# Altium schematic sheet GNSS Antenna.SchDoc: GNSS Antenna & LNA
size 292 x 193 mm; SheetNumber: 14; SheetTotal: 15
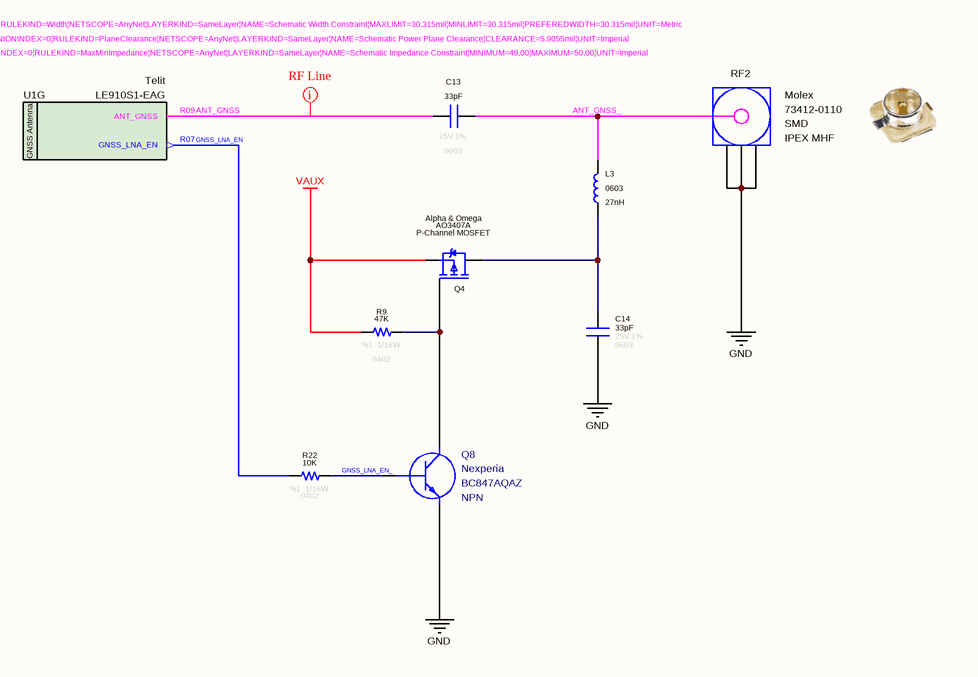
[diagram p0: GNSS Antenna.SchDoc]

## Parts
C13  value 33pF  Tolerance: 1%  Case: 0603  Voltage: 25V  [CAPACITOR_0603]  (hidden comment: Capacitor - 33pF [0603] (Ceramic))
C14  value 33pF  Tolerance: 1%  Case: 0603  Voltage: 25V  [CAPACITOR_0603]  (hidden comment: Capacitor - 33pF [0603] (Ceramic))
L3  value 27nH  Case: 0603  [INDUCTOR_0603]  (hidden comment: Fixed Inductor)
Q4  Manufacturer Name: Alpha & Omega  Manufacturer Part Number: AO3407A  Polarity: P-Channel MOSFET  [SOT-23-3 (Mosfet)]  (hidden comment: BC847AQAZ)
Q8  Manufacturer Name: Nexperia  Polarity: NPN  [SOT1215]  (hidden comment: BC847AQAZ)
R9  value 47K  Tolerance: %1  Case: 0402  Power: 1/16W  [RESISTOR_0402]  (hidden comment: 47K - 0402 - %1 - 1/16W)
R22  value 10K  Tolerance: %1  Case: 0402  Power: 1/16W  [RESISTOR_0402]  (hidden comment: 10K - 0402 - %1 - 1/16W)
RF2  Connector Type: IPEX MHF  Case: SMD  Manufacturer Name: Molex  [Connector_IPEX]  (hidden comment: 73412-0110)
U1  Manufacturer Part Number: LE910S1-EAG  Manufacturer Name: Telit  [LE910 GSM Modem]  (hidden comment: LE910S1-EAG LTE GSM Module)  (part G of 19)

## Nets
GND: C14.1 Q8.2(E) RF2.2(GND) RF2.3(GND) RF2.4(GND)
VAUX: Q4.S(Source) R9.2
ANT_GNSS: C13.2 U1.R09(ANT_GNSS)
ANT_GNSS_: C13.1 L3.2 RF2.1(Signal)
GNSS_LNA_EN: R22.2 U1.R07(GNSS_LNA_EN)
GNSS_LNA_EN_: Q8.1(B) R22.1
NetC14_2: C14.2 L3.1 Q4.D(Drain)
NetQ4_G: Q4.G(Gate) Q8.3(C) R9.1

## Layout directives
rule Impedance Constraint [Min = 49.00    Max = 50.00    ]; rule Power Plane Clearance [Clearance = 5.906mil]; rule Width Constraint [Pref Width = 0.77mm    Min Width = 0.77mm    Max Width = 0.77mm]: ANT_GNSS

## Notes on the sheet
- © 2021 All rights reserved.
  This document may not, in whole or in part, be copied, photocopied, reproduced, translated or converted to any electronic or machine readable from without prior written permission of Mehmet Günce Akkoyun.
  Engineer contact : akkoyun@me.com
- Property of
- Engineer :
- Date :
- Size :
- A4
- Time :
- Project :
- Page :
- /
- Customer :
- Product ID :
- Module ID :
- Version :
- File :
- Revision :
- (in symbol IC - LE910S1-EAG, part G) GNSS Antenna

## Library data of the parts
C13 C14 = Capacitor - 33pF [0603-25V]: Manufacturer Name: Kyocera AVX; Manufacturer Part Number: 06033A330F4T2A; ComponentLink1Description: DataSheet; ComponentLink1URL: https://api.kemet.com/component-edge/download/datasheet/C0402C330J9RACAUTO.pdf; ComponentLink2Description: Mouser; ComponentLink2URL: https://www.mouser.com/Search/Refine.aspx?Keyword=80-C0402C330J9RAUTO
L3 = Inductor - 27nH [0603]: Manufacturer Name: Murata Electronics; Manufacturer Part Number: LQW18AN27NJ00D; Tolerance: 5%; Height: 0.8mm; ComponentLink1Description: DataSheet; ComponentLink1URL: https://www.mouser.com.tr/datasheet/2/281/JELF243B-0009-1699631.pdf
Q4 = Transistor - AO3407A (Mosfet): Bipolar NPN Transistors; Case: SOT23-3
Q8 = Transistor - BC847: Bipolar NPN Transistors; Case: DFN-1010D-3; Manufacturer Part Number: BC847AQAZ
R9 = Resistor - 47K [0402]: Thick Film Resistors - SMD 1/16 W 47 KOhm 1%; Manufacturer Name: Vishay; Manufacturer Part Number: CRCW040247K0FKED; ComponentLink1Description: DataSheet; ComponentLink1URL: https://www.mouser.com.tr/datasheet/2/427/dcrcwe3-1762152.pdf; ComponentLink2Description: Mouser; ComponentLink2URL: https://www.mouser.com.tr/ProductDetail/Vishay-Dale/CRCW040247K0FKED?qs=sGAEpiMZZMu61qfTUdNhG2DpbjADlD3GL%252B3h1elTxqU%3D
R22 = Resistor - 10K [0402]: Thick Film Resistors - SMD 1/16 W 10 KOhm 1%; Manufacturer Name: Vishay; Manufacturer Part Number: CRCW040210K0FKED; ComponentLink1Description: DataSheet; ComponentLink1URL: https://www.mouser.com.tr/datasheet/2/427/dcrcwe3-1762152.pdf; ComponentLink2Description: Mouser; ComponentLink2URL: https://www.mouser.com.tr/ProductDetail/Vishay-Dale/CRCW040210K0FKED?qs=sGAEpiMZZMu61qfTUdNhG2DpbjADlD3GcalbOv9utCY%3D
RF2 = Connector - IPEX MHF: MOLEX   73412-0110   RF COAXIAL, MICROCOAXIAL, JACK, 50OHM; ROHS: Yes; Product Type: RF Connectors; Impedance: 50 Ohm; System: Connector; Manufacturer Part Number: 73412-0110
U1 = IC - LE910S1-EAG: Telit LE910S1-EAG GPRS/GNSS Module; Case: BGA